# EAGLE schematic receiver_ra02_5v (EAGLE 7.7.0)
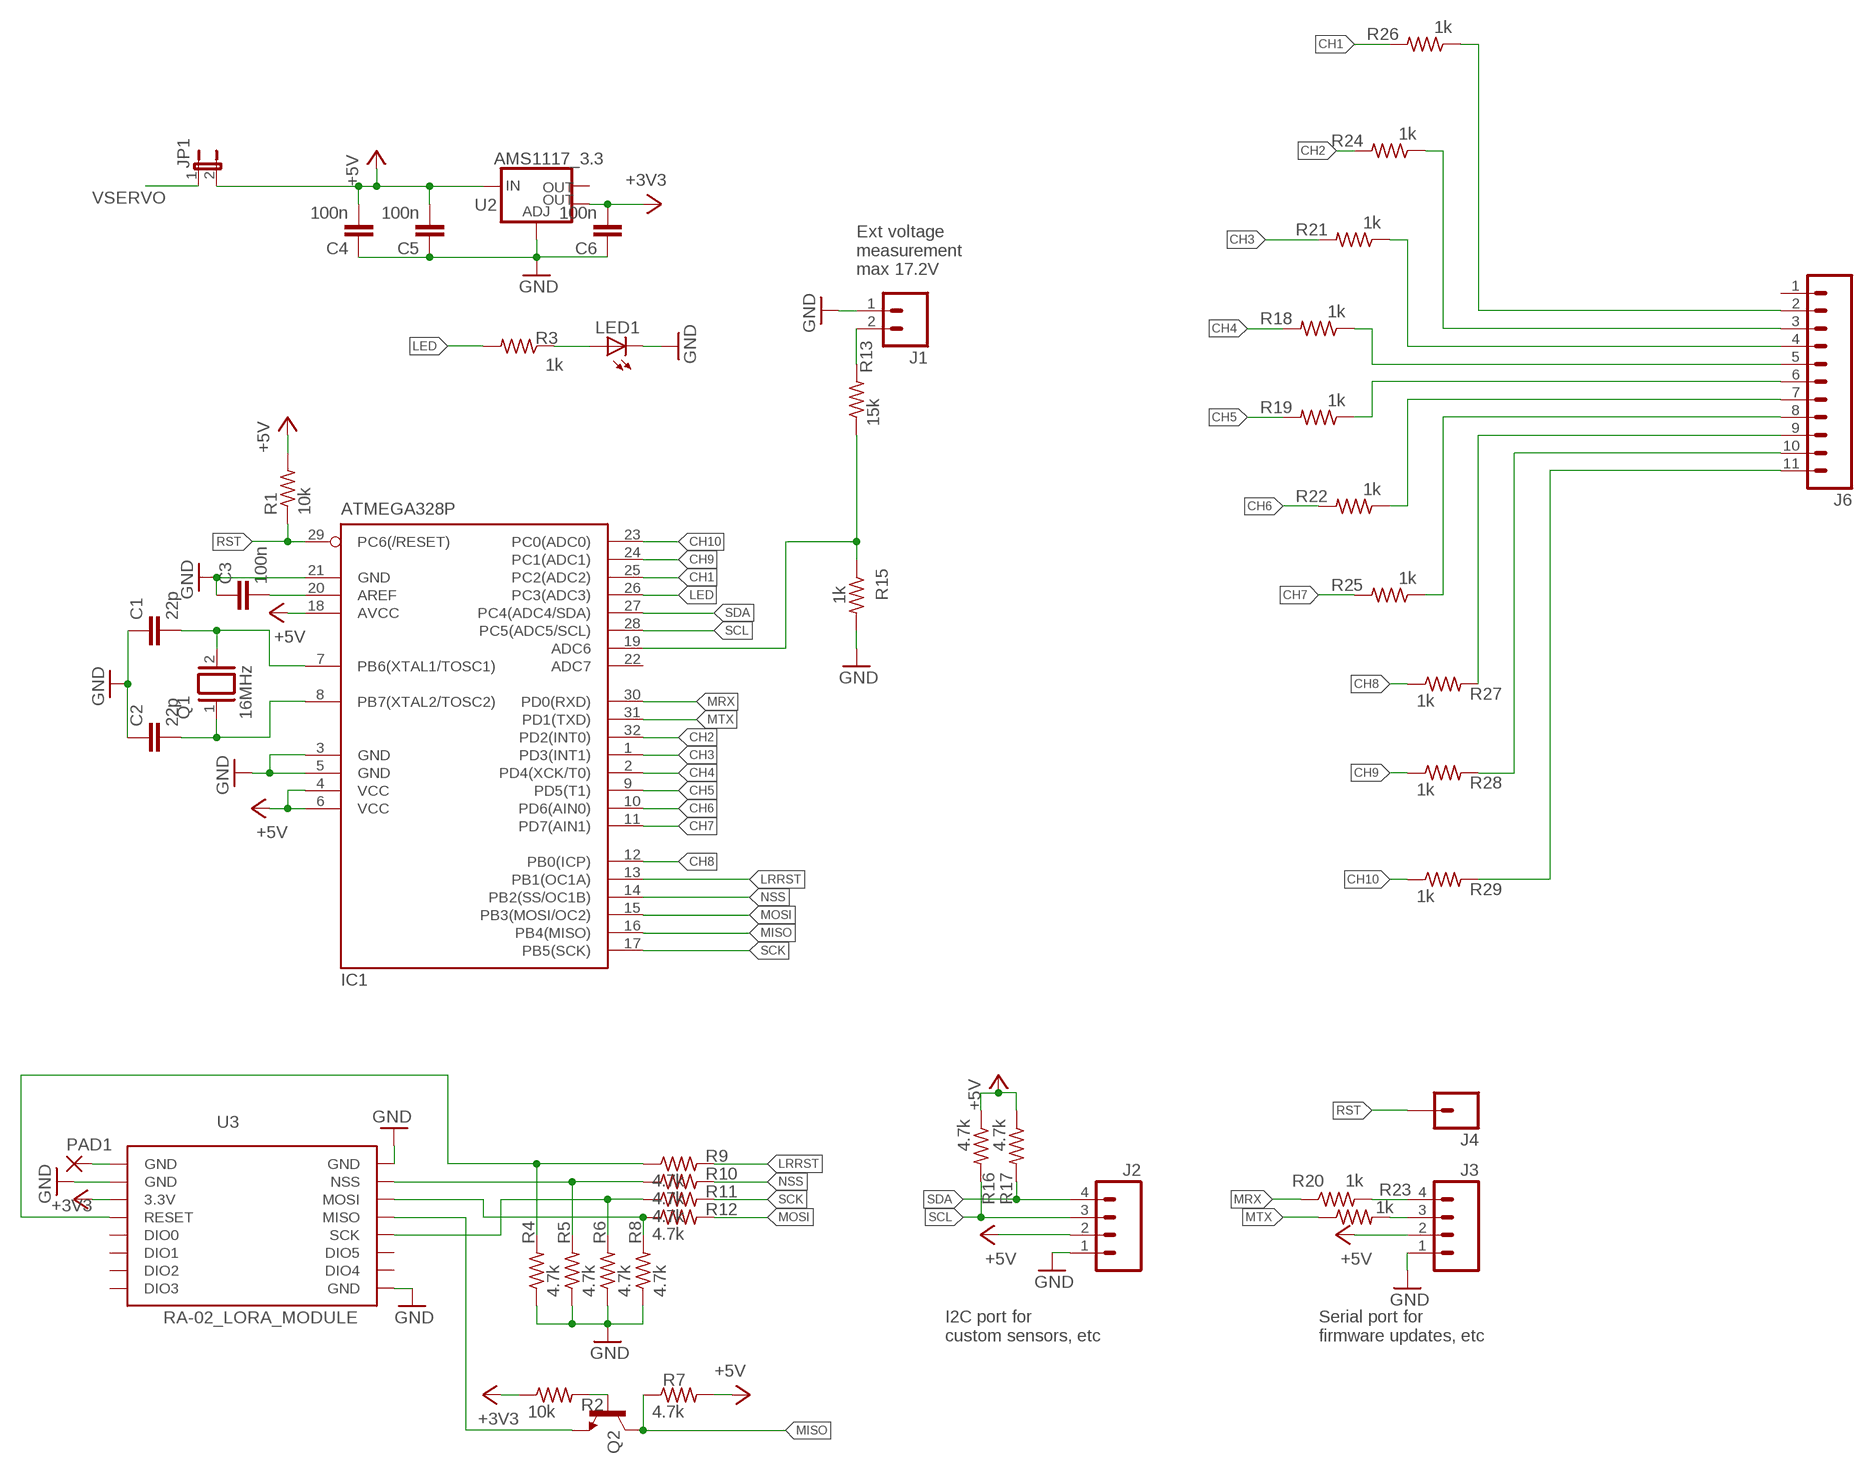
[diagram p0: schematic, sheet 1]

## Parts
C1  22p  C-EUC0805K  [C0805K]
C2  22p  C-EUC0805K  [C0805K]
C3  100n  C-EUC0805K  [C0805K]
C4  100n  C-EUC0805K  [C0805K]
C5  100n  C-EUC0805K  [C0805K]
C6  100n  C-EUC0805K  [C0805K]
IC1  ATMEGA328P  MEGA8-AI  [TQFP32-08]
J1  M02PTH  [1X02]
J2  M04PTH  [1X04]
J3  M04PTH  [1X04]
J4  M01PTH  [1X01]
J6  M11PTH  [1X11]
JP1  JP1E  [JP1]
LED1  LEDCHIPLED_1206  [CHIPLED_1206]
PAD1  2,15/1,0  [2,15/1,0]
Q1  16MHz  XTAL/S  [QS]
Q2  BC817-16SMD  [SOT23-BEC]
R1  10k  R-US_R0805  [R0805]
R2  10k  R-US_R0805  [R0805]
R3  1k  R-US_R0805  [R0805]
R4  4.7k  R-US_R0805  [R0805]
R5  4.7k  R-US_R0805  [R0805]
R6  4.7k  R-US_R0805  [R0805]
R7  4.7k  R-US_R0805  [R0805]
R8  4.7k  R-US_R0805  [R0805]
R9  4.7k  R-US_R0805  [R0805]
R10  4.7k  R-US_R0805  [R0805]
R11  4.7k  R-US_R0805  [R0805]
R12  4.7k  R-US_R0805  [R0805]
R13  15k  R-US_R0805  [R0805]
R15  1k  R-US_R0805  [R0805]
R16  4.7k  R-US_R0805  [R0805]
R17  4.7k  R-US_R0805  [R0805]
R18  1k  R-US_R0805  [R0805]
R19  1k  R-US_R0805  [R0805]
R20  1k  R-US_R0805  [R0805]
R21  1k  R-US_R0805  [R0805]
R22  1k  R-US_R0805  [R0805]
R23  1k  R-US_R0805  [R0805]
R24  1k  R-US_R0805  [R0805]
R25  1k  R-US_R0805  [R0805]
R26  1k  R-US_R0805  [R0805]
R27  1k  R-US_R0805  [R0805]
R28  1k  R-US_R0805  [R0805]
R29  1k  R-US_R0805  [R0805]
U2  AMS1117_3.3  V_REG_LM1117SOT223  [SOT223]
U3  RA-02_LORA_MODULE  [RA-02]

## Nets
+3V3: C6.2 R2.1 U2.4(OUT) U3.3.3V
+5V: C4.2 C5.2 IC1.4(VCC) IC1.6(VCC) IC1.18(AVCC) J2.2 J3.2 JP1.2 R1.2 R7.2 R16.1 R17.1 U2.3(IN)
CH1: IC1.25(PC2(ADC2)) R26.2
CH2: IC1.32(PD2(INT0)) R24.2
CH3: IC1.1(PD3(INT1)) R21.2
CH4: IC1.2(PD4(XCK/T0)) R18.2
CH5: IC1.9(PD5(T1)) R19.2
CH6: IC1.10(PD6(AIN0)) R22.2
CH7: IC1.11(PD7(AIN1)) R25.2
CH8: IC1.12(PB0(ICP)) R27.1
CH9: IC1.24(PC1(ADC1)) R28.1
CH10: IC1.23(PC0(ADC0)) R29.1
GND: C1.1 C2.1 C3.1 C4.1 C5.1 C6.1 IC1.3(GND) IC1.5(GND) IC1.21(GND) J1.1 J2.1 J3.1 LED1.C R4.1 R5.1 R6.1 R8.1 R15.2 U2.1(ADJ) U3.GND@2(GND) U3.GND@3(GND) U3.GND@4(GND)
LED: IC1.26(PC3(ADC3)) R3.2
LRRST: IC1.13(PB1(OC1A)) R9.2
MISO: IC1.16(PB4(MISO)) Q2.C R7.1
MOSI: IC1.15(PB3(MOSI/OC2)) R12.2
MRX: IC1.30(PD0(RXD)) R20.1
MTX: IC1.31(PD1(TXD)) R23.1
N$1: C1.2 IC1.7(PB6(XTAL1/TOSC1)) Q1.2
N$2: J6.10 R28.2
N$3: C2.2 IC1.8(PB7(XTAL2/TOSC2)) Q1.1
N$4: J6.9 R27.2
N$5: PAD1.1(P) U3.GND
N$6: R4.2 R9.1 U3.RESET
N$7: R5.2 R10.1 U3.NSS
N$8: R6.2 R11.1 U3.SCK
N$9: R8.2 R12.1 U3.MOSI
N$11: Q2.E U3.MISO
N$12: C3.2 IC1.20(AREF)
N$13: IC1.19(ADC6) R13.1 R15.1
N$14: J3.3 R23.2
N$15: LED1.A R3.1
N$18: J6.2 R26.1
N$21: J3.4 R20.2
N$22: J6.3 R24.1
N$24: J6.4 R21.1
N$26: J6.5 R18.1
N$28: J6.6 R19.1
N$30: J6.7 R22.1
N$32: J6.8 R25.1
N$33: Q2.B R2.2
N$35: J1.2 R13.2
N$40: J6.11 R29.2
NSS: IC1.14(PB2(SS/OC1B)) R10.2
RST: IC1.29(PC6(/RESET)) J4.1 R1.1
SCK: IC1.17(PB5(SCK)) R11.2
SCL: IC1.28(PC5(ADC5/SCL)) J2.3 R16.2
SDA: IC1.27(PC4(ADC4/SDA)) J2.4 R17.2
VSERVO: JP1.1
Unconnected: IC1.22(ADC7) J6.1 U2.2(OUT) U3.DIO0 U3.DIO1 U3.DIO2 U3.DIO3 U3.DIO4 U3.DIO5

## Notes on the sheet
- Ext voltage 
  measurement
  max 17.2V
- I2C port for
  custom sensors, etc
- Serial port for
  firmware updates, etc

## Library data of the parts
C1-C6 = rcl:C-EU: CAPACITOR, European symbol
IC1 = atmel:MEGA8: MICROCONTROLLER 8 Kbytes FLASH, 1 kbytes SRAM, 512 bytes EEPROM, USART, 6-channel 10 bit ADC, 2-channel 8 bit ADC Pin compatible with Atmega48, ATMega88, ATMega168 Source: avr.lbr; MPN: ATMEGA8-16AU; OC_FARNELL: 9171371; OC_NEWARK: 73M8863
J1 = SparkFun-Connectors:M02: Standard 2-pin 0.1" header. Use with - straight break away headers ( PRT-00116) - right angle break away headers (PRT-00553) - swiss pins (PRT-00743) - machine pins (PRT-00117) - female headers (PRT-00115) Molex polarized connector foot print use with: PRT-08233 with associated crimp pins and housings. 2.54_SCREWTERM for use with PRT-10571. 3.5mm Screw Terminal footprints for PRT-08084 5mm Screw Terminal footprints for use with PRT-08432
J2 J3 = SparkFun-Connectors:M04: Header 4 Standard 4-pin 0.1" header. Use with straight break away headers (SKU : PRT-00116), right angle break away headers (PRT-00553), swiss pins (PRT-00743), machine pins (PRT-00117), and female headers (PRT-00115). Molex polarized connector foot print use with SKU : PRT-08231 with associated crimp pins and housings. 1MM SMD Version SKU: PRT-10208; PROD_ID: CONN-09696
J4 = SparkFun-Connectors:M01: Header 1 Standard 1-pin 0.1" header. Use with straight break away headers (SKU : PRT-00116), right angle break away headers (PRT-00553), swiss pins (PRT-00743), machine pins (PRT-00117), and female headers (PRT-00115). SMTSO-256-ET is a "flush mount" nut for a 4-40 screw. The older package used to be too tight, and did not allow it to sit properly thru the drill hit. The latest (0.165DIA) fits nice and snug.
J6 = SparkFun-Connectors:M11: Header 11 Standard 11-pin 0.1" header. Use with straight break away headers (SKU : PRT-00116), right angle break away headers (PRT-00553), swiss pins (PRT-00743), machine pins (PRT-00117), and female headers (PRT-00115).
JP1 = jumper:JP1E: JUMPER
LED1 = led:LED: LED OSRAM: - CHIPLED LG R971, LG N971, LY N971, LG Q971, LY Q971, LO R971, LY R971 LH N974, LH R974 LS Q976, LO Q976, LY Q976 LO Q996 - Hyper CHIPLED LW Q18S LB Q993, LB Q99A, LB R99A - SideLED LS A670, LO A670, LY A670, LG A670, LP A670 LB A673, LV A673, LT A673, LW A673 LH A674 LY A675 LS A676, LA A676, LO A676, LY A676, LW A676 LS A679, LY A679, LG A679 - Hyper Micro SIDELED® LS Y876, LA Y876, LO Y876, LY Y876 LT Y87S - SmartLED LW L88C, LW L88S LB L89C, LB L89S, LG L890 LS L89K, LO L89K, LY L89K LS L896, LA L896, LO L896, LY L896 - TOPLED LS T670, LO T670, LY T670, LG T670, LP T670 LSG T670, LSP T670, LSY T670, LOP T670, LYG T670 LG T671, LOG T671, LSG T671 LB T673, LV T673, LT T673, LW T673 LH T674 LS T676, LA T676, LO T676, LY T676, LB T676, LH T676, LSB T676, LW T676 LB T67C, LV T67C, LT T67C, LS T67K, LO T67K, LY T67K, LW E67C LS E67B, LA E67B, LO E67B, LY E67B, LB E67C, LV E67C, LT E67C LW T67C LS T679, LY T679, LG T679 LS T770, LO T770, LY T770, LG T770, LP T770 LB T773, LV T773, LT T773, LW T773 LH T774 LS E675, LA E675, LY E675, LS T675 LS T776, LA T776, LO T776, LY T776, LB T776 LHGB T686 LT T68C, LB T68C - Hyper Mini TOPLED® LB M676 - Mini TOPLED Santana® LG M470 LS M47K, LO M47K, LY M47K Source: http://www.osram.convergy.de LUXEON: - LUMILED® LXK2-PW12-R00, LXK2-PW12-S00, LXK2-PW14-U00, LXK2-PW14-V00 LXK2-PM12-R00, LXK2-PM12-S00, LXK2-PM14-U00 LXK2-PE12-Q00, LXK2-PE12-R00, LXK2-PE12-S00, LXK2-PE14-T00, LXK2-PE14-U00 LXK2-PB12-K00, LXK2-PB12-L00, LXK2-PB12-M00, LXK2-PB14-N00, LXK2-PB14-P00, LXK2-PB14-Q00 LXK2-PR12-L00, LXK2-PR12-M00, LXK2-PR14-Q00, LXK2-PR14-R00 LXK2-PD12-Q00, LXK2-PD12-R00, LXK2-PD12-S00 LXK2-PH12-R00, LXK2-PH12-S00 LXK2-PL12-P00, LXK2-PL12-Q00, LXK2-PL12-R00 Source: www.luxeon.com KINGBRIGHT: KA-3528ASYC Source: www.kingbright.com
PAD1 = wirepad:2,15/1,0: THROUGH-HOLE PAD
Q1 = special:XTAL/S: CRYSTAL
Q2 = transistor-npn:BC817*: NPN Transistor
R1-R13 R15-R29 = rcl:R-US_: RESISTOR, American symbol
U2 = SparkFun-PowerIC:V_REG_LM1117: Voltage Regulator LM1117 Standard adjustable voltage regulator but in SMD form. Spark Fun Electronics SKU : COM-00595; PROD_ID: VREG-08170
U3 = RA-02_Lora_module:RA-02_LORA_MODULE

## Net classes
1 rf: clearance 0.5 mm